# EAGLE design Sens_SHT2x (EAGLE 6.4)
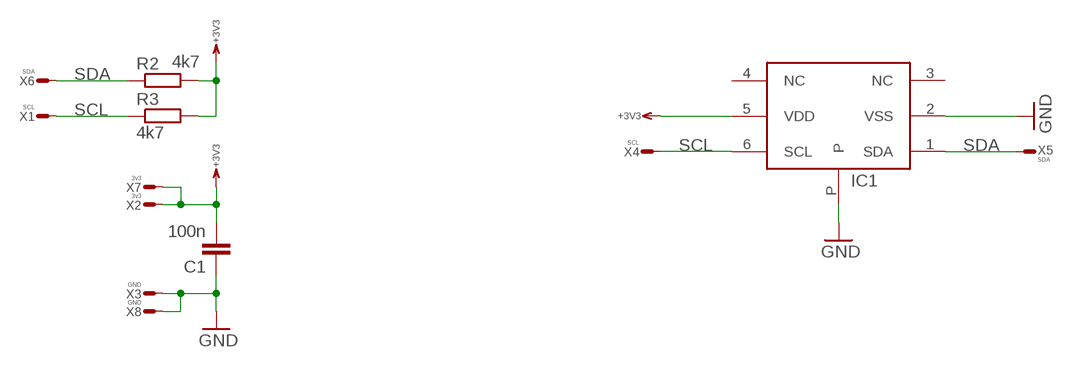
[diagram p0: schematic, sheet 1]

## Parts
C1  100n  C0603  [0603]
IC1  SHT2X  [DFN6]
R2  4k7  R0603  [0603]
R3  4k7  R0603  [0603]
X1  SCL  WIREPADT1.6/0.9  [T1.6/0.9]
X2  3v3  WIREPADT1.6/0.9  [T1.6/0.9]
X3  GND  WIREPADT1.6/0.9  [T1.6/0.9]
X4  SCL  WIREPADT1.6/0.9  [T1.6/0.9]
X5  SDA  WIREPADT1.6/0.9  [T1.6/0.9]
X6  SDA  WIREPADT1.6/0.9  [T1.6/0.9]
X7  3v3  WIREPADT1.6/0.9  [T1.6/0.9]
X8  GND  WIREPADT1.6/0.9  [T1.6/0.9]

## Nets
+3V3: C1.2 IC1.5(VDD) R2.2 R3.2 X2.1(S) X7.1(S)
GND: C1.1 IC1.2(VSS) IC1.P X3.1(S) X8.1(S)
SCL: IC1.6(SCL) R3.1 X1.1(S) X4.1(S)
SDA: IC1.1(SDA) R2.1 X5.1(S) X6.1(S)
Unconnected: IC1.3(NC) IC1.4(NC)

## Library data of the parts
C1 = RCL:C: Capacitor SMD
IC1 = Sensors:SHT2X
R2 R3 = RCL:R: Resistor SMD
X1-X8 = Conn:WIREPAD: Wire PAD connect wire on PCB

## Board
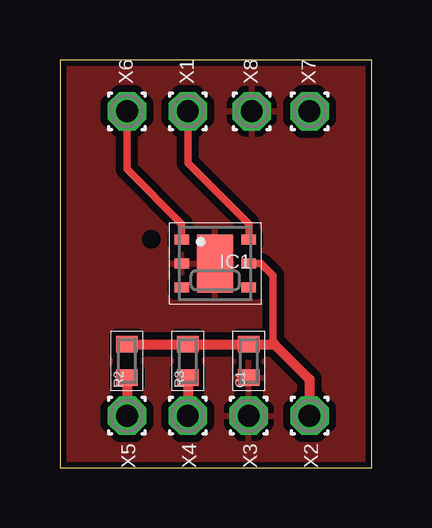
[diagram p1: board, top side]
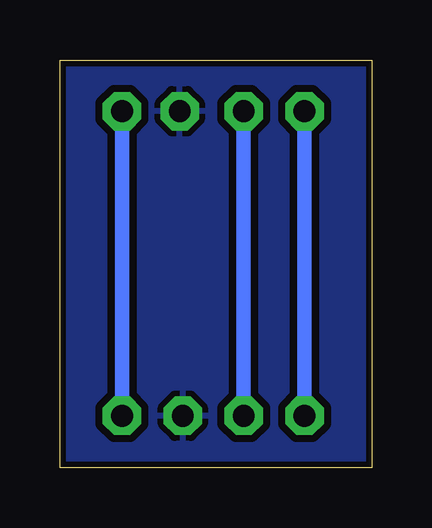
[diagram p2: board, bottom side, seen from below]

Size 13 x 17 mm. Coordinates in mm from the lower left corner, seen from the top.
Outline: 0,0 13,0 13,17 0,17 0,0
Copper layers (1*16): Top 0.035mm / dielectric 1.5mm / Bottom 0.035mm
Design rules "default *": minimum track width 10mil, minimum drill 12mil, track to track 12mil, track to pad 12mil, pad to pad 12mil, via to via 12mil, smd to smd 12mil, copper to edge 10mil, drill to drill 8mil, minimum pad ring 10mil, minimum via ring 8mil, stop-mask expansion 4mil, vias tented up to drill 0mil, thermal gap 10mil
tRestrict: area 3.4,9.1 to 4.2,9.9

### Footprints (pad centres in the part's own frame; a part is rotated, then mirrored left to right if it is on the bottom)
0603 = smd 0.7 x 0.9: 1 -0.697,0; 2 0.697,0
DFN6 = smd 0.6 x 0.4: 1 1.4,-1; 2 1.4,0; 3 1.4,1; 4 -1.4,1; 5 -1.4,0; 6 -1.4,-1 | smd 1.5 x 2.4: P 0,0
T1.6/0.9 = drill 0.914 pad 1.6 octagon: 1 0,0

### Placement (x,y rotation side)
C1  7.87,4.45 90 top
IC1  6.48,8.51 180 top
R2  2.79,4.45 90 top
R3  5.33,4.45 90 top
X1  5.33,14.86 90 top
X2  10.41,2.16 270 top
X3  7.87,2.16 270 top
X4  5.33,2.16 270 top
X5  2.79,2.16 270 top
X6  2.79,14.86 90 top
X7  10.41,14.86 90 top
X8  8,14.86 90 top

### Tracks (layer width: path | path; a pad name or v marks a point on that pad's centre or on a via)
+3V3
  Top 0.305: IC1.5 8.38,8.51 8.89,8 8.89,5.14
  Top 0.406: R2.2 R3.2 C1.2 8.89,5.14 8.96,5.14 10.41,3.68 X2.1
  Bottom 0.61: X7.1 X2.1
GND
  pour Top: 0,17 13,17 13,0 0,0
  pour Bottom: 0,0 13,0 13,17 0,17
SCL
  Top 0.305: IC1.6 7.88,10.16 5.33,12.7 X1.1
  Top 0.406: R3.1 X4.1
  Bottom 0.61: X4.1 X1.1
SDA
  Top 0.305: IC1.1 5.08,10.16 2.79,12.45 X6.1
  Top 0.406: R2.1 X5.1
  Bottom 0.61: X5.1 X6.1